# EAGLE design ByrneLite (EAGLE 6.3)
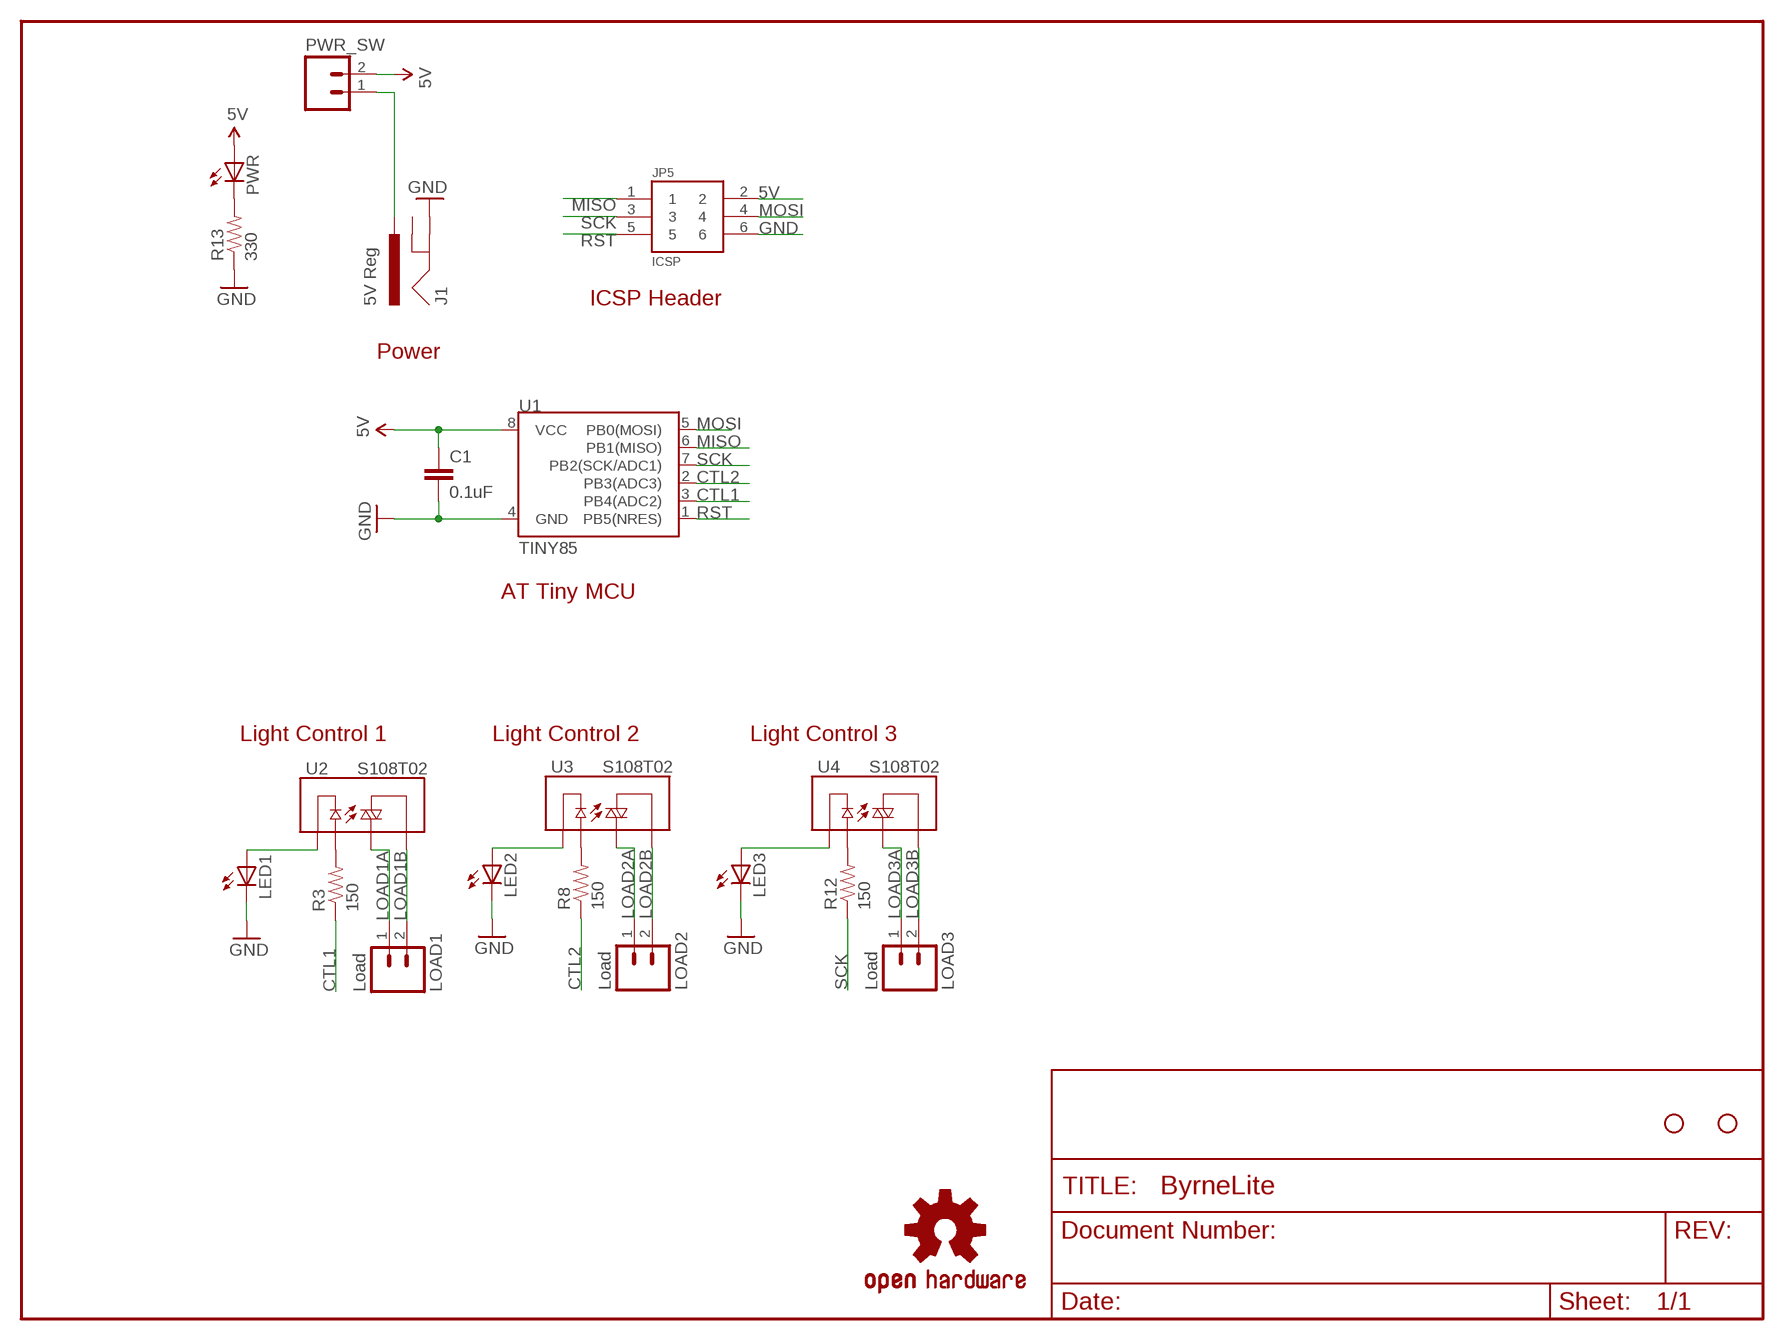
[diagram p0: schematic, sheet 1]

## Parts
C1  0.1uF  CAPPTH2  [CAP-PTH-SMALL2]
J1  5V Reg  POWER_JACKPTH_LOCK  [POWER_JACK_PTH_LOCK]
JP5  ICSP  M03X2  [2X3-SHROUDED]
LED1  LED5MM  [LED5MM]
LED2  LED5MM  [LED5MM]
LED3  LED5MM  [LED5MM]
LOAD1  Load  M025MM  [SCREWTERMINAL-5MM-2]
LOAD2  Load  M025MM  [SCREWTERMINAL-5MM-2]
LOAD3  Load  M025MM  [SCREWTERMINAL-5MM-2]
LOGO1  OSHW-LOGOM  [OSHW-LOGO-M]
PWR  LED3MM  [LED3MM]
PWR_SW  M02PTH3  [1X02_LONGPADS]
R3  150  RESISTORAXIAL-0.3  [AXIAL-0.3]
R8  150  RESISTORAXIAL-0.3  [AXIAL-0.3]
R12  150  RESISTORAXIAL-0.3  [AXIAL-0.3]
R13  330  RESISTORAXIAL-0.3  [AXIAL-0.3]
STANDOFF2  STAND-OFF  [STAND-OFF]
STANDOFF4  STAND-OFF  [STAND-OFF]
U1  TINY85  ATTINY45TINY85-20-DIP  [DIP08]
U2  S108T02  RELAY-SOLIDSTATEPTH  [RELAY-S108T02]
U3  S108T02  RELAY-SOLIDSTATEPTH  [RELAY-S108T02]
U4  S108T02  RELAY-SOLIDSTATEPTH  [RELAY-S108T02]

## Nets
5V [pwr]: C1.1 JP5.2 PWR.A PWR_SW.2 U1.8(VCC)
CTL1: R3.P$1 U1.3(PB4(ADC2))
CTL2: R8.P$1 U1.2(PB3(ADC3))
GND [pwr]: C1.2 J1.GND JP5.6 LED1.K(C) LED2.K(C) LED3.K(C) R13.P$1 U1.4(GND)
LOAD1A [pwr]: LOAD1.1 U2.2(T2)
LOAD1B [pwr]: LOAD1.2 U2.1(T1)
LOAD2A [pwr]: LOAD2.1 U3.2(T2)
LOAD2B [pwr]: LOAD2.2 U3.1(T1)
LOAD3A [pwr]: LOAD3.1 U4.2(T2)
LOAD3B [pwr]: LOAD3.2 U4.1(T1)
MISO: JP5.1 U1.6(PB1(MISO))
MOSI: JP5.4 U1.5(PB0(MOSI))
N$1: R3.P$2 U2.3(+)
N$2: LED2.A U3.4(-)
N$3: R8.P$2 U3.3(+)
N$4: LED3.A U4.4(-)
N$5: J1.PWR PWR_SW.1
N$6: LED1.A U2.4(-)
N$7: R12.P$2 U4.3(+)
N$12: PWR.K(C) R13.P$2
RST: JP5.5 U1.1(PB5(NRES))
SCK: JP5.3 R12.P$1 U1.7(PB2(SCK/ADC1))
Unconnected: J1.GNDBREAK

## Notes on the sheet
- ICSP Header
- Power
- AT Tiny MCU
- Light Control 1 | Light Control 2 | Light Control 3

## Library data of the parts
C1 = SparkFun-Capacitors:CAP: Capacitor Standard 0603 ceramic capacitor, and 0.1" leaded capacitor.
J1 = Dek:POWER_JACK: Power Jack This is the standard 5.5mm barrel jack for power. The PTH is the most common, proven, reliable, footprint. All others are experimental. The Slot footprint only works if the mill layer is transmitted to the PCB fab house so be warned. Spark Fun Electronics SKU : PRT-00119. Mating wall wart : TOL-00298 (and others)
JP5 = SparkFun-Connectors:M03X2: 2x3 .1" header. Shrouded, with keying- CONN-10681 SMT- ??? (4UCON 15881); PROD_ID: CONN-10681
LED1-LED3 PWR = SparkFun:LED: LEDs Standard schematic elements and footprints for 5mm, 3mm, 1206, and 0603 sized LEDs. 5mm - Spark Fun Electronics SKU : COM-00529 (and others)
LOAD1-LOAD3 = SparkFun:M02: Header 2 Standard 2-pin 0.1" header. Use with straight break away headers (SKU : PRT-00116), right angle break away headers (PRT-00553), swiss pins (PRT-00743), machine pins (PRT-00117), and female headers (PRT-00115). Molex polarized connector foot print use with SKU : PRT-08233 with associated crimp pins and housings.
LOGO1 = SparkFun-Aesthetics:OSHW-LOGO: Open Source Hardware Logo This logo indicates the piece of hardware it is found on incorporates a OSHW license and/or adheres to the definition of open source hardware found here: http://freedomdefined.org/OSHW
PWR_SW = SparkFun-Connectors:M02: Header 2 Standard 2-pin 0.1" header. Use with straight break away headers (SKU : PRT-00116), right angle break away headers (PRT-00553), swiss pins (PRT-00743), machine pins (PRT-00117), and female headers (PRT-00115). Molex polarized connector foot print use with SKU : PRT-08233 with associated crimp pins and housings.
R3 R8 R12 R13 = SparkFun:RESISTOR: Resistor Basic schematic elements and footprints for 0603, 1206, and PTH resistors.
STANDOFF2 STANDOFF4 = SparkFun-Electromechanical:STAND-OFF: #4 Stand Off This is the mechanical footprint for a #4 phillips button head screw. Use the keepout ring to avoid running the screw head into surrounding components. SKU : PRT-00447
U1 = SparkFun-DigitalIC:ATTINY45: Atmel 8-pin 2/4/8kB flash uC; PROD_ID: IC-09445; VALUE: TINY85-20-DIP
U2-U4 = SparkFun:RELAY-SOLIDSTATE

## Board
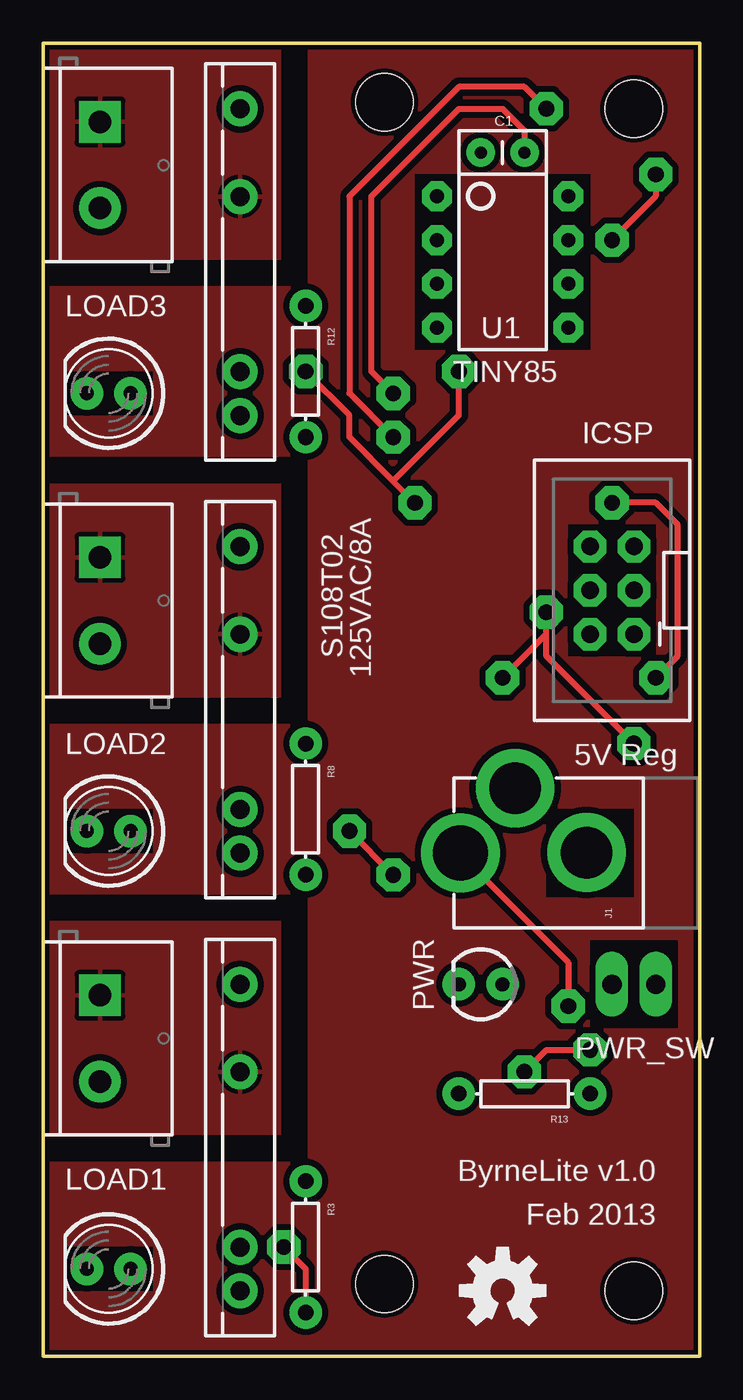
[diagram p1: board, top side]
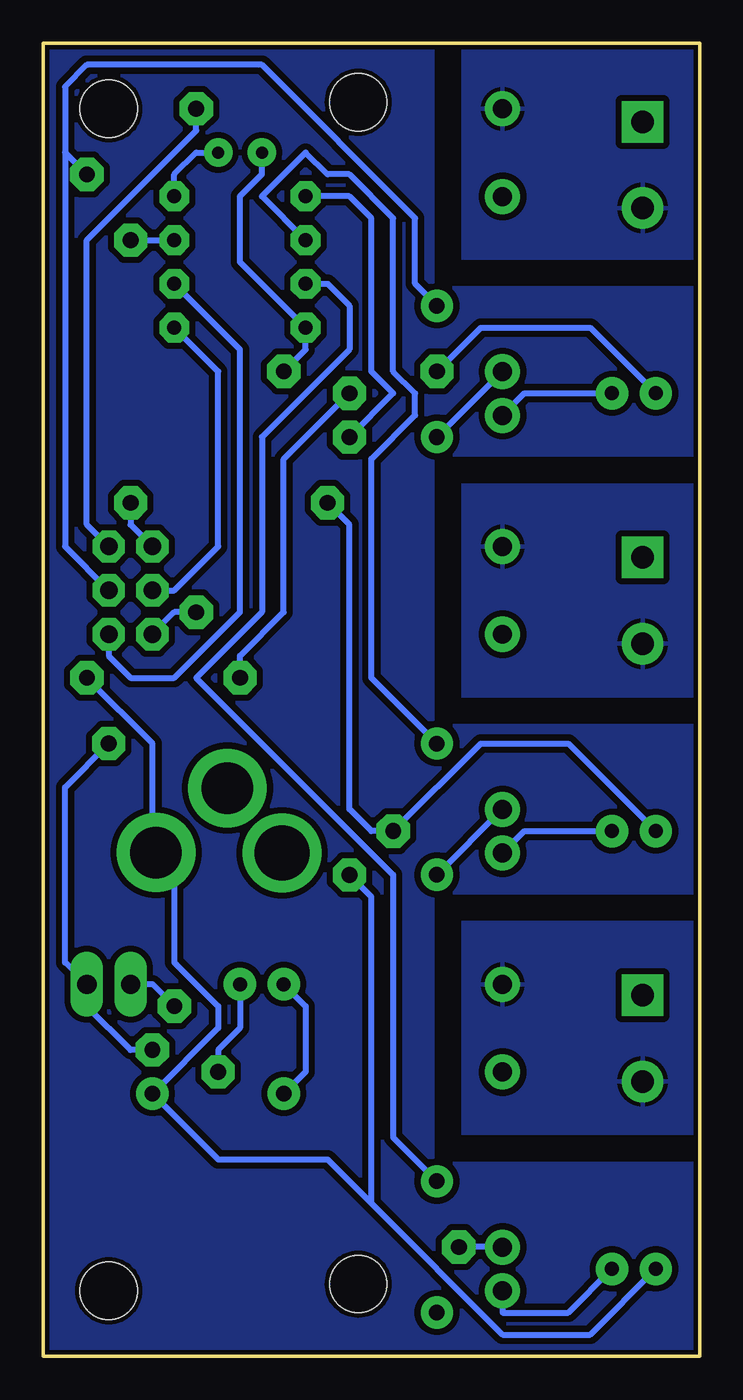
[diagram p2: board, bottom side, seen from below]

Size 38.1 x 76.2 mm. Coordinates in mm from the lower left corner, seen from the top.
Outline: 0,0 38.1,0 38.1,76.2 0,76.2 0,0
Copper layers (1*16): Top 0.035mm / dielectric 1.5mm / Bottom 0.035mm
Design rules "Dek": minimum track width 14mil, minimum drill 36mil, track to track 14mil, track to pad 14mil, pad to pad 14mil, via to via 14mil, smd to smd 0mil, copper to edge 10mil, drill to drill 12mil, minimum pad ring 12mil, minimum via ring 20mil, stop-mask expansion 4mil, vias tented up to drill 25mil, thermal gap 10mil
tRestrict: area 30.5,40.6 to 35.6,48.3; area 29.2,58.4 to 31.8,68.6; area 21.6,58.4 to 24.1,68.6; area 29.2,26.7 to 34.3,31.8; area 0,11.4 to 15.2,26.7; area 0,62.2 to 15.2,76.2; area 0,36.8 to 15.2,52.1; area 31.8,19.1 to 36.8,24.1; area 1.3,29.2 to 6.3,31.8; area 1.3,3.8 to 6.3,6.3; area 1.3,54.6 to 6.3,57.1
bRestrict: area 0,11.4 to 15.2,26.7; area 0,36.8 to 15.2,52.1; area 0,62.2 to 15.2,76.2

### Footprints (pad centres in the part's own frame; a part is rotated, then mirrored left to right if it is on the bottom)
CAP-PTH-SMALL2 = drill 0.7 pad 1.651: 1 0,0; 2 2.54,0
POWER_JACK_PTH_LOCK = drill 2.997 pad 4.572: GND 0.025,6.557; GNDBREAK 3.762,10.7 | drill 3.2 pad 4.572: PWR 0,13.878
2X3-SHROUDED = drill 1.016 pad 1.88 octagon: 1 -1.27,2.54; 2 1.27,2.54; 3 -1.27,0; 4 1.27,0; 5 -1.27,-2.54; 6 1.27,-2.54
LED5MM = drill 0.813 pad 1.88: A -1.27,0; K 1.27,0
SCREWTERMINAL-5MM-2 = drill 1.3 pad 2.413 square: 1 0,0 | drill 1.3 pad 2.413: 2 5,0
LED3MM = drill 0.813 pad 1.88: A -1.27,0; K 1.27,0
1X02_LONGPADS = drill 1.118 pad 1.88 long: 1 0,0; 2 2.54,0
AXIAL-0.3 = drill 0.9 pad 1.88: P$1 -3.81,0; P$2 3.81,0
STAND-OFF = hole 3.302: 0,0
DIP08 = drill 0.813 pad 1.727 octagon: 1 -3.81,-3.81; 2 -1.27,-3.81; 3 1.27,-3.81; 4 3.81,-3.81; 5 3.81,3.81; 6 1.27,3.81; 7 -1.27,3.81; 8 -3.81,3.81
RELAY-S108T02 = drill 1.1 pad 2.032: 1 -8.88,0; 2 -3.8,0; 3 6.36,0; 4 8.9,0

### Placement (x,y rotation side)
C1  27.94,69.85 180 top
J1  38.1,29.21 90 top
JP5  33.02,44.45 180 top
LED1  3.81,5.08 180 top
LED2  3.81,30.48 180 top
LED3  3.81,55.88 180 top
LOAD1  3.3,20.95 270 top
LOAD2  3.3,46.35 270 top
LOAD3  3.3,71.63 270 top
LOGO1  26.67,3.81 0 top
PWR  25.4,21.59 180 top
PWR_SW  33.02,21.59 0 top
R3  15.24,6.35 270 top
R8  15.24,31.75 270 top
R12  15.24,57.15 270 top
R13  27.94,15.24 180 top
STANDOFF1  STAND-OFF  [STAND-OFF]  19.81,4.19 0 top
STANDOFF2  34.29,3.81 0 top
STANDOFF3  STAND-OFF  [STAND-OFF]  19.81,72.77 0 top
STANDOFF4  34.29,72.39 0 top
U1  26.67,63.5 270 top
U2  11.43,12.7 270 top
U3  11.43,38.1 270 top
U4  11.43,63.5 270 top

### Tracks (layer width: path | path; a pad name or v marks a point on that pad's centre or on a via)
5V  (via drill 0.91)
  Top 0.356: v31.75,17.78 29.21,17.78 v27.94,16.51 | 29.21,41.91 29.21,40.64 v34.29,35.56 | 29.21,41.91 v29.21,43.18 | C1.1 27.94,71.12 26.67,72.39 24.13,72.39 19.05,67.31 19.05,57.15 v20.32,55.88 | 29.21,41.91 v26.67,39.37
  Bottom 0.356: C1.1 29.21,69.85 30.48,68.58 U1.8 | v31.75,17.78 33.02,17.78 35.56,20.32 PWR_SW.2 36.83,22.86 36.83,33.02 v34.29,35.56 | v27.94,16.51 27.94,17.78 26.67,19.05 PWR.A | JP5.2 30.48,43.18 v29.21,43.18 | v20.32,55.88 24.13,52.07 24.13,43.18 26.67,40.64 v26.67,39.37
CTL1
  Bottom 0.356: R3.P$1 17.78,12.7 17.78,27.94 29.21,39.37 25.4,43.18 25.4,53.34 20.32,58.42 20.32,60.96 21.59,62.23 U1.3
CTL2
  Bottom 0.356: U1.2 25.4,67.31 22.86,69.85 21.59,68.58 20.32,68.58 17.78,66.04 17.78,57.15 16.51,55.88 16.51,54.61 19.05,52.07 19.05,39.37 R8.P$1
GND  (via drill 0.91)
  Top 0.356: v20.32,27.94 v17.78,30.48 | v15.24,57.15 17.78,54.61 17.78,53.34 20.32,50.8 | v21.59,49.53 20.32,50.8 | v33.02,49.53 35.56,49.53 36.83,48.26 36.83,40.64 v35.56,39.37 | v24.13,57.15 24.13,54.61 20.32,50.8
  Bottom 0.356: C1.2 25.4,68.58 26.67,67.31 26.67,63.5 U1.4 22.86,58.42 v24.13,57.15 | LED1.K 6.35,1.27 11.43,1.27 19.05,8.89 | 19.05,8.89 21.59,11.43 27.94,11.43 R13.P$1 27.94,19.05 27.94,20.32 30.48,22.86 30.48,29.21 J1.GND 31.75,30.48 31.75,35.56 v35.56,39.37 | LED2.K 7.62,35.56 12.7,35.56 v17.78,30.48 19.05,30.48 20.32,31.75 20.32,48.26 v21.59,49.53 | v20.32,27.94 19.05,26.67 19.05,8.89 | LED3.K 6.35,59.69 12.7,59.69 v15.24,57.15 | JP5.6 33.02,48.26 v33.02,49.53
LOAD1A
  pour Top: 13.97,12.7 13.97,25.4 -1.27,25.4 -1.27,12.7
LOAD1B
  pour Bottom: 13.97,12.7 13.97,25.4 -2.54,25.4 -2.54,12.7
LOAD2A
  pour Top: 13.97,38.1 13.97,50.8 -1.27,50.8 -1.27,38.1
LOAD2B
  pour Bottom: 13.97,38.1 13.97,50.8 -2.54,50.8 -2.54,38.1
LOAD3A
  pour Top: 13.97,63.5 13.97,76.2 -1.27,76.2 -1.27,63.5
LOAD3B
  pour Bottom: 13.97,63.5 13.97,76.2 -2.54,76.2 -2.54,63.5
MISO
  Bottom 0.356: U1.6 26.67,58.42 26.67,43.18 30.48,39.37 33.02,39.37 34.29,40.64 JP5.1
MOSI
  Bottom 0.356: U1.5 27.94,57.15 27.94,46.99 30.48,44.45 JP5.4
N$1  (via drill 0.91)
  Top 0.356: R3.P$2 15.24,5.08 v13.97,6.35
  Bottom 0.356: v13.97,6.35 U2.3
N$2
  Bottom 0.356: LED2.A 10.16,30.48 U3.4
N$3
  Bottom 0.356: R8.P$2 U3.3
N$4
  Bottom 0.356: LED3.A 10.16,55.88 U4.4
N$5  (via drill 0.91)
  Top 0.356: v30.48,20.32 30.48,22.86 24.13,29.21 J1.PWR
  Bottom 0.356: PWR_SW.1 31.75,21.59 v30.48,20.32
N$6
  Bottom 0.356: LED1.A 7.62,2.54 11.43,2.54 U2.4
N$7
  Bottom 0.356: R12.P$2 U4.3
N$8
  pour Bottom: 0,0 0,11.43 15.24,11.43 15.24,26.67 0,26.67 0,36.83 15.24,36.83 15.24,52.07 0,52.07 0,62.23 15.24,62.23 15.24,76.2 38.1,76.2 38.1,0
N$9
  pour Top: 0,0 0,11.43 15.24,11.43 15.24,26.67 0,26.67 0,36.83 15.24,36.83 15.24,52.07 0,52.07 0,62.23 15.24,62.23 15.24,76.2 38.1,76.2 38.1,0
N$12
  Bottom 0.356: R13.P$2 22.86,16.51 22.86,20.32 PWR.K
RST  (via drill 0.91)
  Top 0.356: v20.32,53.34 17.78,55.88 17.78,67.31 24.13,73.66 27.94,73.66 v29.21,72.39
  Bottom 0.356: U1.1 20.32,67.31 19.05,66.04 19.05,57.15 17.78,55.88 v20.32,53.34 | v29.21,72.39 29.21,71.12 35.56,64.77 35.56,48.26 JP5.5
SCK  (via drill 0.91)
  Top 0.356: v33.02,64.77 35.56,67.31 v35.56,68.58
  Bottom 0.356: v33.02,64.77 U1.7 | 36.83,69.85 v35.56,68.58 | 36.83,69.85 36.83,73.66 35.56,74.93 25.4,74.93 16.51,66.04 16.51,62.23 R12.P$1 | JP5.3 36.83,46.99 36.83,69.85

### Text on the board
tPlace: S108T02 | 125VAC/8A | ByrneLite v1.0 | Feb 2013